# EAGLE design Wheel speed tester rev1 (EAGLE 9.6.2)
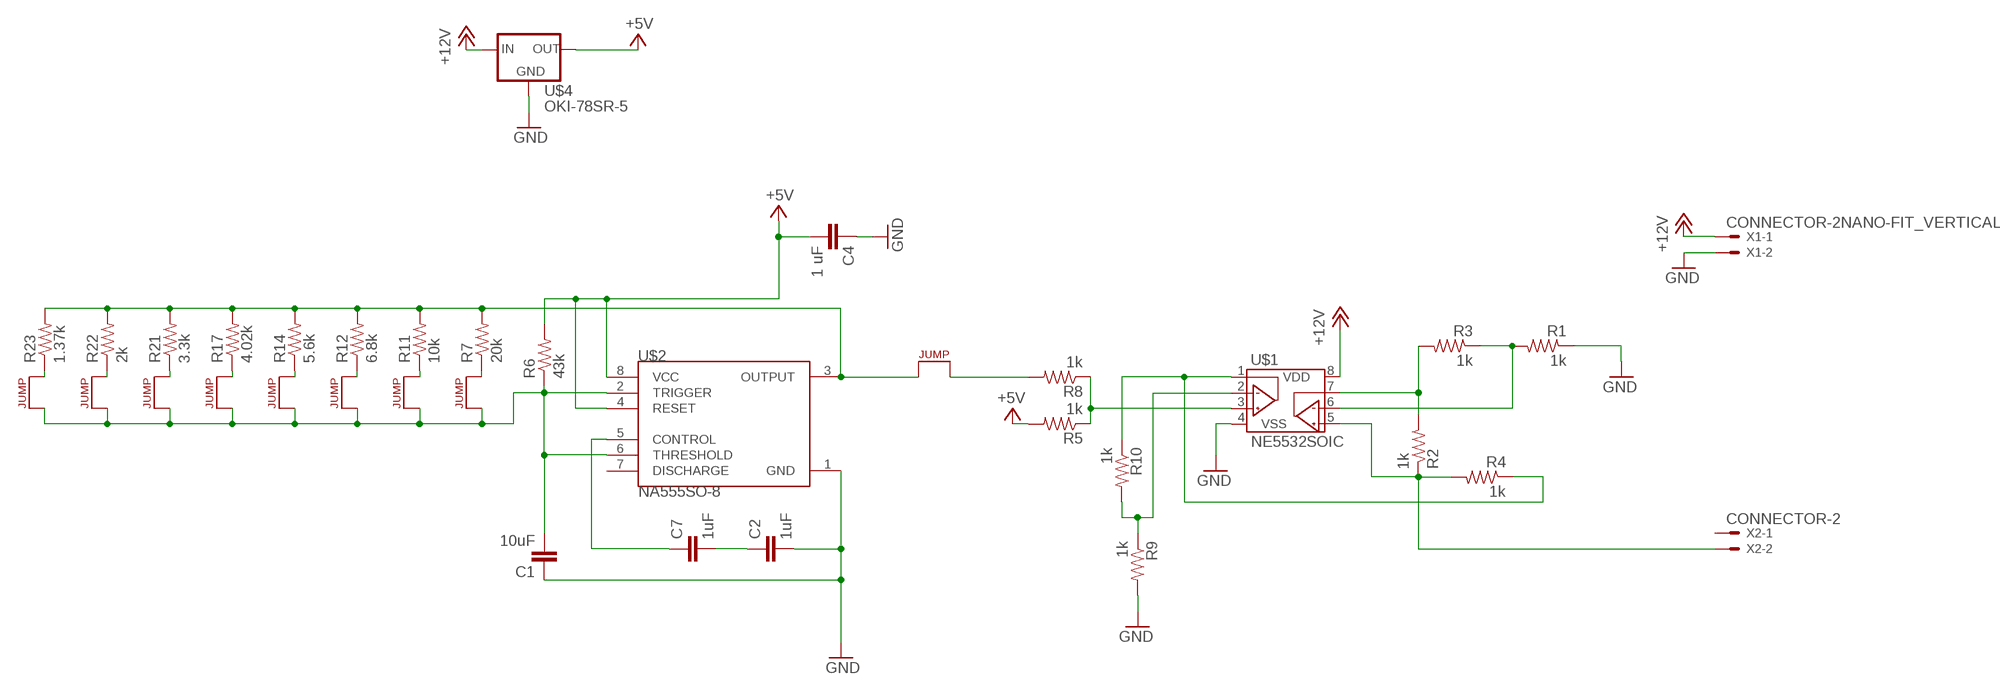
[diagram p0: schematic, sheet 1, part 1 of 2]
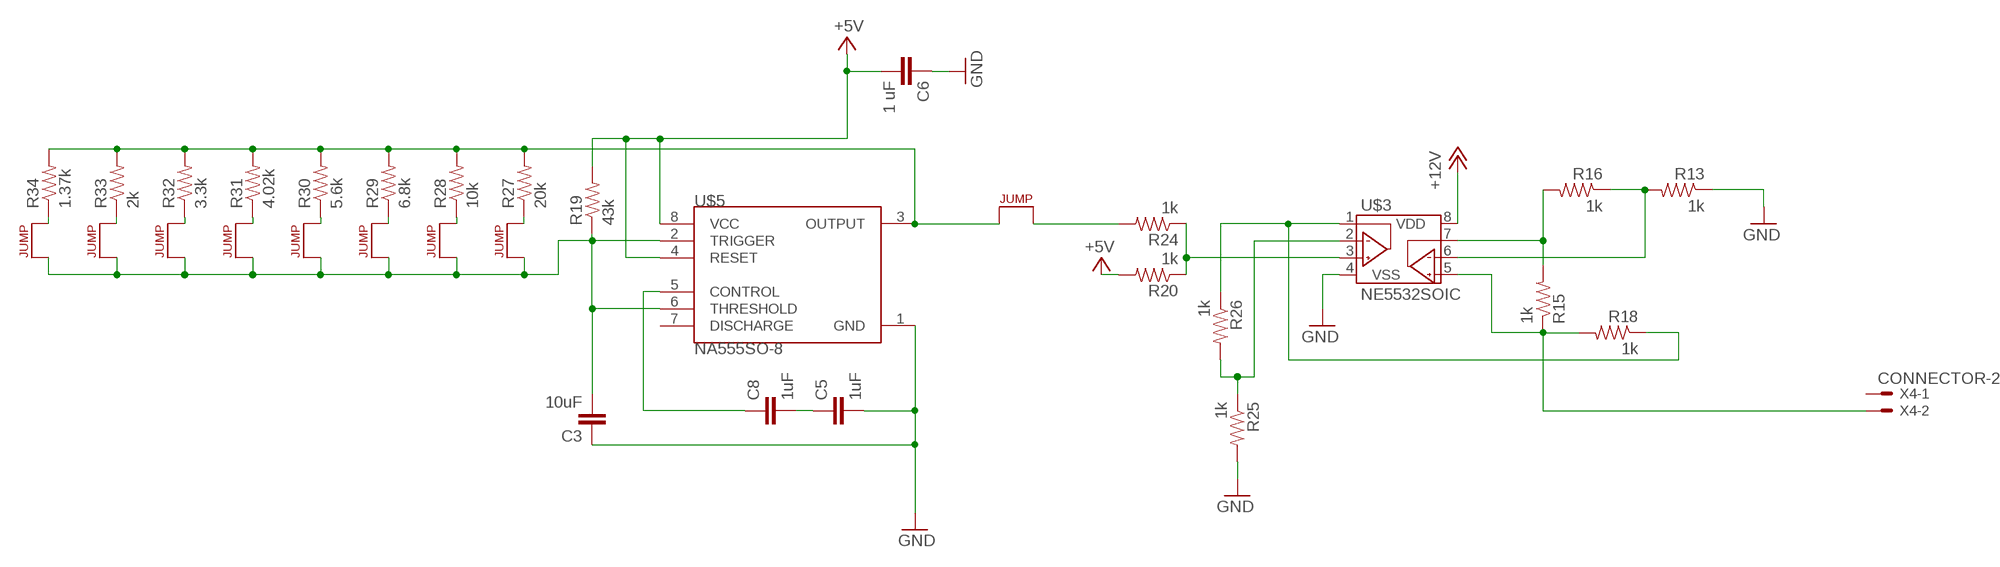
[diagram p1: schematic, sheet 1, part 2 of 2]

## Parts
C1  10uF  CAP0603-CAP  [0603-CAP]
C2  1uF  CAP0603-CAP  [0603-CAP]
C3  10uF  CAP0603-CAP  [0603-CAP]
C4  1 uF  CAP0603-CAP  [0603-CAP]
C5  1uF  CAP0603-CAP  [0603-CAP]
C6  1 uF  CAP0603-CAP  [0603-CAP]
C7  1uF  CAP0603-CAP  [0603-CAP]
C8  1uF  CAP0603-CAP  [0603-CAP]
J1  JUMPER.1  [1X02]
J2  JUMPER.1  [1X02]
J3  JUMPER.1  [1X02]
J4  JUMPER.1  [1X02]
J5  JUMPER.1  [1X02]
J6  JUMPER.1  [1X02]
J7  JUMPER.1  [1X02]
J8  JUMPER.1  [1X02]
J9  JUMPER.1  [1X02]
J10  JUMPER.1  [1X02]
J11  JUMPER.1  [1X02]
J12  JUMPER.1  [1X02]
J13  JUMPER.1  [1X02]
J14  JUMPER.1  [1X02]
J15  JUMPER.1  [1X02]
J16  JUMPER.1  [1X02]
J17  JUMPER.1  [1X02]
J18  JUMPER.1  [1X02]
R1  1k  RESISTOR0603  [0603-RES]
R2  1k  RESISTOR0603  [0603-RES]
R3  1k  RESISTOR0603  [0603-RES]
R4  1k  RESISTOR0603  [0603-RES]
R5  1k  RESISTOR0603  [0603-RES]
R6  43k  RESISTOR0603  [0603-RES]
R7  20k  RESISTOR0603  [0603-RES]
R8  1k  RESISTOR0603  [0603-RES]
R9  1k  RESISTOR0603  [0603-RES]
R10  1k  RESISTOR0603  [0603-RES]
R11  10k  RESISTOR0603  [0603-RES]
R12  6.8k  RESISTOR0603  [0603-RES]
R13  1k  RESISTOR0603  [0603-RES]
R14  5.6k  RESISTOR0603  [0603-RES]
R15  1k  RESISTOR0603  [0603-RES]
R16  1k  RESISTOR0603  [0603-RES]
R17  4.02k  RESISTOR0603  [0603-RES]
R18  1k  RESISTOR0603  [0603-RES]
R19  43k  RESISTOR0603  [0603-RES]
R20  1k  RESISTOR0603  [0603-RES]
R21  3.3k  RESISTOR0603  [0603-RES]
R22  2k  RESISTOR0603  [0603-RES]
R23  1.37k  RESISTOR0603  [0603-RES]
R24  1k  RESISTOR0603  [0603-RES]
R25  1k  RESISTOR0603  [0603-RES]
R26  1k  RESISTOR0603  [0603-RES]
R27  20k  RESISTOR0603  [0603-RES]
R28  10k  RESISTOR0603  [0603-RES]
R29  6.8k  RESISTOR0603  [0603-RES]
R30  5.6k  RESISTOR0603  [0603-RES]
R31  4.02k  RESISTOR0603  [0603-RES]
R32  3.3k  RESISTOR0603  [0603-RES]
R33  2k  RESISTOR0603  [0603-RES]
R34  1.37k  RESISTOR0603  [0603-RES]
U$1  NE5532SOIC  [SOIC-08]
U$2  NA555SO-8  [SOIC-08]
U$3  NE5532SOIC  [SOIC-08]
U$4  OKI-78SR-5  [OKI-78SR]
U$5  NA555SO-8  [SOIC-08]
X1  CONNECTOR-2NANO-FIT_VERTICAL-2  [NANO-FIT_VERTICAL-2]
X2  CONNECTOR-2  [MINIFIT_5566-2]
X4  CONNECTOR-2  [MINIFIT_5566-2]

## Nets
+5V: C4.2 C6.2 R5.2 R6.2 R19.2 R20.2 U$2.4(RESET) U$2.8(VCC) U$4.3(OUT) U$5.4(RESET) U$5.8(VCC)
+12V: U$1.8(VDD) U$3.8(VDD) U$4.1(IN) X1.P$1
ALTERNATINGVOLTAGE: R4.1 R10.1 U$1.1(VOUTA)
ALTERNATINGVOLTAGE1: R18.1 R26.1 U$3.1(VOUTA)
GND: C1.1 C2.2 C3.1 C4.1 C5.2 C6.1 R1.1 R9.2 R13.1 R25.2 U$1.4(VSS) U$2.1(GND) U$3.4(VSS) U$4.2(GND) U$5.1(GND) X1.P$2
N$1: R2.2 R3.2 U$1.7(VOUTB)
N$2: R1.2 R3.1 U$1.6(VINB-)
N$3: C7.1 U$2.5(CONTROL)
N$4: J2.2 R8.2
N$5: C1.2 J1.1 J3.1 J4.1 J5.1 J6.1 J7.1 J8.1 J9.1 R6.1 U$2.2(TRIGGER) U$2.6(THRESHOLD)
N$6: R5.1 R8.1 U$1.3(VINA+)
N$7: J9.2 R7.1
N$8: J2.1 R7.2 R11.2 R12.2 R14.2 R17.2 R21.2 R22.2 R23.2 U$2.3(OUTPUT)
N$9: R9.1 R10.2 U$1.2(VINA-)
N$10: J8.2 R11.1
N$11: J7.2 R12.1
N$12: J6.2 R14.1
N$13: J5.2 R17.1
N$14: J4.2 R21.1
N$15: J3.2 R22.1
N$16: J1.2 R23.1
N$17: R13.2 R16.1 U$3.6(VINB-)
N$18: J10.1 R27.2 R28.2 R29.2 R30.2 R31.2 R32.2 R33.2 R34.2 U$5.3(OUTPUT)
N$19: R20.1 R24.1 U$3.3(VINA+)
N$20: R15.2 R16.2 U$3.7(VOUTB)
N$21: R25.1 R26.2 U$3.2(VINA-)
N$22: C3.2 J11.1 J12.1 J13.1 J14.1 J15.1 J16.1 J17.1 J18.1 R19.1 U$5.2(TRIGGER) U$5.6(THRESHOLD)
N$23: C8.1 U$5.5(CONTROL)
N$24: J10.2 R24.2
N$25: J18.2 R27.1
N$26: J17.2 R28.1
N$27: J16.2 R29.1
N$28: J15.2 R30.1
N$29: J14.2 R31.1
N$30: J13.2 R32.1
N$31: J12.2 R33.1
N$32: J11.2 R34.1
N$33: C2.1 C7.2
N$34: C5.1 C8.2
SENSOROUT: R2.1 R4.2 U$1.5(VINB+) X2.2
SENSOROUT1: R15.1 R18.2 U$3.5(VINB+) X4.2
Unconnected: U$2.7(DISCHARGE) U$5.7(DISCHARGE) X2.1 X4.1

## Library data of the parts
C1-C8 = HyTechDevices:CAP: Capacitor Standard 0603 ceramic capacitor, and 0.1" leaded capacitor.
J1-J18 = HyTechDevices:JUMPER: Jumper for changing operation of a device
R1-R34 = HyTechDevices:RESISTOR: Resistor Basic schematic elements and footprints for 0603, 1206, and PTH resistors.
U$1 U$3 = HyTechDevices:NE5532: TI NE5532 Dual Channel Op Amp
U$2 U$5 = HyTechDevices:NA555: Texas Instruments NA555 timer. Data sheet <http://www.ti.com/lit/ds/symlink/se555.pdf>
U$4 = HyTechDevices:OKI-78SR-5: Murata OKI-78SR 5V 1.5A Non-Isolated Switching Regulator DC/DC - Datasheet <https://power.murata.com/data/power/oki-78sr.pdf>
X1 = HyTechDevices:CONNECTOR-2: Mini-Fit Junior connector 2 pole Source: http://www.molex.com
X2 X4 = HyTechDevices:CONNECTOR-2: Mini-Fit Junior connector 2 pole Source: http://www.molex.com; OC_FARNELL: 1822072; OC_NEWARK: unknown

## Board
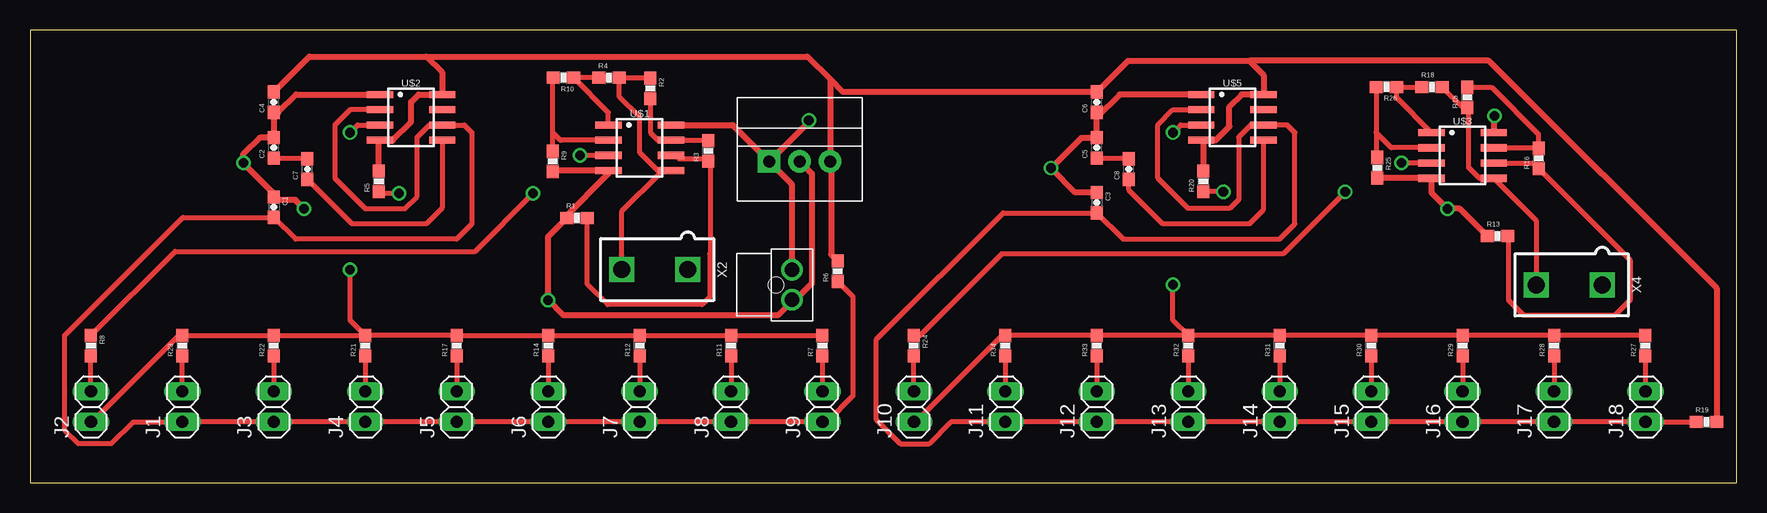
[diagram p2: board, top side]
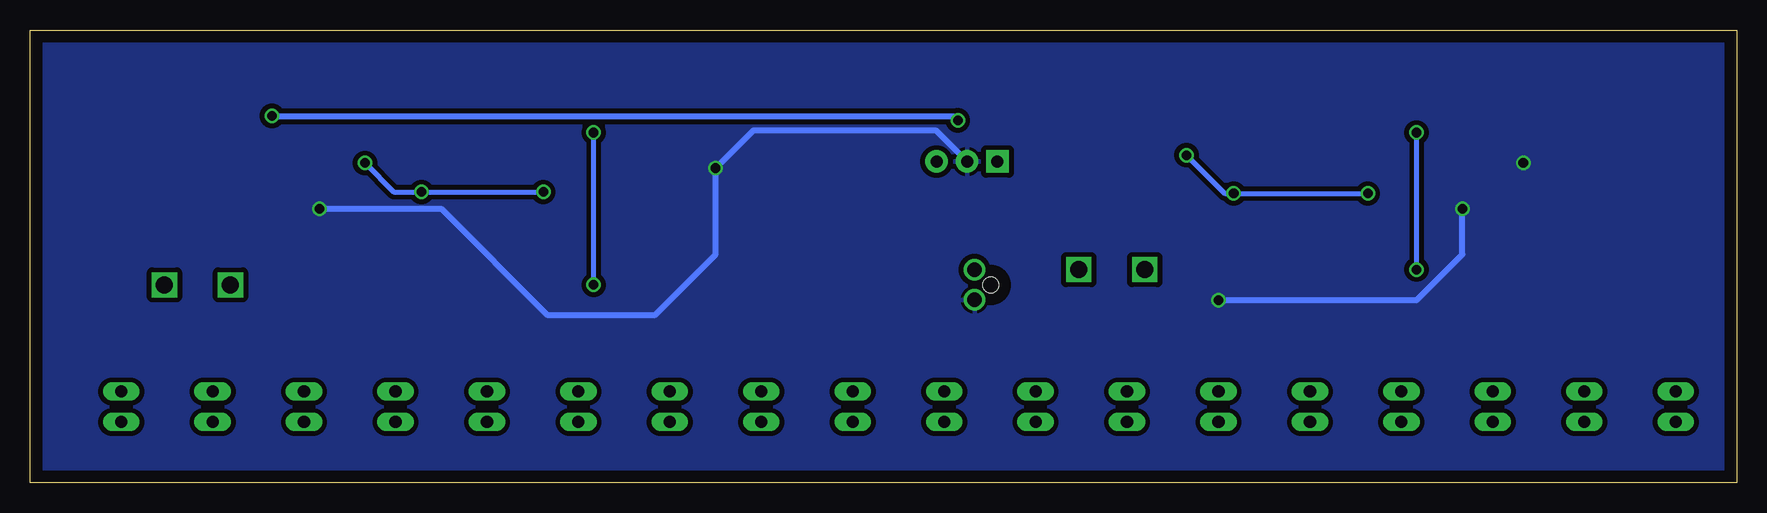
[diagram p3: board, bottom side, seen from below]

Size 142.22 x 37.77 mm. Coordinates in mm from the lower left corner, seen from the top.
Outline: 0,0 142.22,0 142.22,37.77 0,37.77 0,0
Copper layers (1*16): Top 0.035mm / dielectric 1.5mm / Bottom 0.035mm
Design rules "On Campus (2 Layer)": minimum track width 16mil, minimum drill 0.8mm, track to track 16mil, track to pad 12mil, pad to pad 16mil, via to via 16mil, smd to smd 10mil, copper to edge 40mil, drill to drill 10mil, minimum pad ring 10mil, minimum via ring 8mil, stop-mask expansion 4mil, vias tented up to drill 0mil, thermal gap 10mil

### Footprints (pad centres in the part's own frame; a part is rotated, then mirrored left to right if it is on the bottom)
0603-CAP = smd 1.1 x 1: 1 -0.85,0; 2 0.85,0
1X02 = drill 1.016 long: 1 -1.27,0; 2 1.27,0
0603-RES = smd 1.1 x 1: 1 -0.85,0; 2 0.85,0
SOIC-08 = smd 0.6 x 2.2: 1 -1.905,-2.6; 2 -0.635,-2.6; 3 0.635,-2.6; 4 1.905,-2.6; 5 1.905,2.6; 6 0.635,2.6; 7 -0.635,2.6; 8 -1.905,2.6
OKI-78SR = drill 1 pad 1.88 square: 1 -2.54,0 | drill 1 pad 1.88: 2 0,0; 3 2.54,0
NANO-FIT_VERTICAL-2 = drill 1.2: P$1 -1.25,0; P$2 1.25,0 | hole 1.3: 0,-1.34
MINIFIT_5566-2 = drill 1.4 square: 1 0,-2.75; 2 0,2.75

### Placement (x,y rotation side)
C1  20.32,22.99 270 top
C2  20.32,27.94 90 top
C3  88.9,23.37 270 top
C4  20.32,31.75 90 top
C5  88.9,27.94 90 top
C6  88.9,31.75 90 top
C7  23.11,26.16 90 top
C8  91.57,26.16 90 top
J1  12.7,6.35 90 top
J2  5.08,6.35 90 top
J3  20.32,6.35 90 top
J4  27.94,6.35 90 top
J5  35.56,6.35 90 top
J6  43.18,6.35 90 top
J7  50.8,6.35 90 top
J8  58.42,6.35 90 top
J9  66.04,6.35 90 top
J10  73.66,6.35 90 top
J11  81.28,6.35 90 top
J12  88.9,6.35 90 top
J13  96.52,6.35 90 top
J14  104.14,6.35 90 top
J15  111.76,6.35 90 top
J16  119.38,6.35 90 top
J17  127,6.35 90 top
J18  134.62,6.35 90 top
R1  45.59,22.1 0 top
R2  51.69,32.89 270 top
R3  56.52,27.69 90 top
R4  48.26,33.78 0 top
R5  29.08,25.15 90 top
R6  67.31,17.65 90 top
R7  66.04,11.43 90 top
R8  5.08,11.43 270 top
R9  43.56,26.8 270 top
R10  44.45,33.78 180 top
R11  58.42,11.43 90 top
R12  50.8,11.43 90 top
R13  122.3,20.57 0 top
R14  43.18,11.43 90 top
R15  119.76,32.13 90 top
R16  125.73,27.05 90 top
R17  35.56,11.43 90 top
R18  116.84,33.02 0 top
R19  139.7,5.08 0 top
R20  97.79,25.15 90 top
R21  27.94,11.43 90 top
R22  20.32,11.43 90 top
R23  12.7,11.43 90 top
R24  73.66,11.43 270 top
R25  112.27,26.29 270 top
R26  113.03,33.02 180 top
R27  134.62,11.43 90 top
R28  127,11.43 90 top
R29  119.38,11.43 90 top
R30  111.76,11.43 90 top
R31  104.14,11.43 90 top
R32  96.52,11.43 90 top
R33  88.9,11.43 90 top
R34  81.28,11.43 90 top
U$1  50.8,27.94 270 top
U$2  31.75,30.48 270 top
U$3  119.38,27.3 270 top
U$4  64.14,26.8 0 top
U$5  100.2,30.48 270 top
X1  63.5,16.51 270 top
X2  52.07,17.78 90 top
X4  128.27,16.51 90 top

### Tracks (layer width: path | path; a pad name or v marks a point on that pad's centre or on a via)
+5V
  Top 0.508: C4.2 23.28,35.56 33.02,35.56 | 66.67,33.66 64.77,35.56 33.02,35.56 | 66.67,33.66 U$4.3 66.76,26.71 66.76,19.05 R6.2 | 66.67,33.66 67.73,32.6 C6.2 91.51,35.21 101.6,35.21 | R19.2 140.55,16.23 121.57,35.21 101.6,35.21 | 33.02,35.56 34.35,34.23 U$2.8 32.38,32.39 31.75,31.75 31.75,30.09 30.24,28.58 U$2.4 29.08,28.51 R5.2 | 101.6,35.21 102.8,34 U$5.8 100.96,32.39 99.95,31.37 99.95,29.72 98.81,28.58 U$5.4 97.79,28.39 R20.2
+12V  (via drill 0.8)
  Top 0.508: U$1.8 58.55,29.84 U$4.1 | v64.9,30.23 64.9,30.1 U$4.1 | X1.P$1 63.47,17.78 63.47,24.92 U$4.1 | v122.05,30.61 121.98,30.54 U$3.8
  Bottom 0.508: v122.05,30.61 121.97,30.53 65.2,30.53 v64.9,30.23
ALTERNATINGVOLTAGE
  Top 0.406: R4.1 R10.1 48.2,30.88 U$1.1
ALTERNATINGVOLTAGE1
  Top 0.406: U$3.1 113.88,32.11 R26.1 R18.1
GND  (via drill 0.8)
  Top 0.406: 112.31,25.4 R25.2
  Top 0.508: R9.2 43.47,26.03 U$1.4 48.2,25.78 44.52,22.1 R1.1 43.18,20.53 v43.18,15.24 44.45,13.97 62.33,13.97 63.5,15.13 X1.P$2 63.77,15.26 65.15,16.64 65.15,25.78 U$4.2 | 88.9,30.48 C5.2 87.63,28.79 v85.09,26.25 87.12,24.22 C3.1 | 88.9,30.48 C6.1 | 112.31,25.4 U$3.4 116.78,24.19 v118.11,22.86 119.17,22.86 R13.1 | U$5.1 90.8,32.39 88.9,30.48 | U$2.1 22.19,32.39 20.7,30.9 C4.1 C2.2 19.12,28.79 17.78,27.45 v17.78,26.67 20.32,24.13 C1.1 20.32,23.58 22.11,23.58 v22.85,22.85
  Bottom 0.508: U$4.2 66.75,29.41 81.93,29.41 v85.09,26.25 85.09,19.05 90.17,13.97 99.06,13.97 107.95,22.86 v118.11,22.86 | v43.18,15.24 26.67,15.24 22.86,19.05 v22.86,22.86 v22.85,22.85
  pour Bottom: 0,38.1 0,0 142.24,0 142.24,38.1
N$1
  Top 0.406: R2.2 51.69,29.21 52.32,28.58 U$1.7 56.48,28.58 R3.2
N$2
  Top 0.406: R1.2 46.44,16.55 48.13,14.86 56.01,14.86 56.64,15.49 56.64,19.09 56.73,19.18 56.73,26.62 56.6,26.75 R3.1 56.35,27 54.08,27 53.78,27.3 U$1.6
N$3
  Top 0.406: U$2.5 34.35,22.92 33.02,21.59 26.84,21.59 C7.1
N$4
  Top 0.406: J2.2 R8.2
N$5
  Top 0.406: R6.1 68.58,15.53 68.58,7.24 66.42,5.08 J9.1 J8.1 J7.1 J6.1 J5.1 J4.1 J3.1 J1.1 8.58,5.08 6.78,3.28 4.01,3.28 2.9,4.4 2.9,12.3 12.73,22.14 C1.2 22.14,20.32 35.56,20.32 36.83,21.59 36.83,29.21 36.19,29.84 U$2.6 33.27,29.84 32.26,28.83 32.26,23.88 31.24,22.86 27.94,22.86 25.4,25.4 25.4,29.84 26.67,31.12 U$2.2
N$6  (via drill 0.8)
  Top 0.406: R8.1 12.1,19.3 37.08,19.3 v41.91,24.13 | v30.73,24.13 29.25,24.13 R5.1 | v45.85,27.33 48.18,27.33 U$1.3
  Bottom 0.406: v45.85,27.33 42.65,24.13 v41.91,24.13 v30.73,24.13
N$7
  Top 0.406: R7.1 J9.2
N$8  (via drill 0.8)
  Top 0.406: J2.1 5.21,5.08 12.41,12.28 R23.2 R22.2 R21.2 | R21.2 R17.2 R14.2 R12.2 R11.2 R7.2 | R21.2 26.67,13.55 v26.67,17.78 | v26.67,29.21 27.3,29.84 U$2.3
  Bottom 0.406: v26.67,17.78 v26.67,29.21
N$9
  Top 0.406: R9.1 43.56,29.21 | 43.56,29.21 43.56,33.74 R10.2 | U$1.2 44.2,28.58 43.56,29.21
N$10
  Top 0.406: R11.1 J8.2
N$11
  Top 0.406: R12.1 J7.2
N$12
  Top 0.406: R14.1 J6.2
N$13
  Top 0.406: R17.1 J5.2
N$14
  Top 0.406: R21.1 J4.2
N$15
  Top 0.406: R22.1 J3.2
N$16
  Top 0.406: J1.2 R23.1
N$17
  Top 0.406: U$3.6 125.26,26.67 R16.1 133.35,18.58 133.35,15.24 132.08,13.97 124.46,13.97 123.19,15.24 123.19,20.53 R13.2
N$18  (via drill 0.8)
  Top 0.406: R27.2 R28.2 R29.2 R30.2 R31.2 R32.2 | R32.2 R33.2 R34.2 81.03,12.28 73.83,5.08 J10.1 | R32.2 95.25,13.55 v95.25,16.51 | v95.25,29.21 95.89,29.84 U$5.3
  Bottom 0.406: v95.25,16.51 v95.25,29.21
N$19  (via drill 0.8)
  Top 0.406: R24.1 74.17,12.28 80.98,19.09 85.09,19.09 104.43,19.09 v109.6,24.26 | U$3.3 v114.3,26.67 | v99.44,24.26 99.4,24.3 R20.1
  Bottom 0.406: v114.3,26.67 111.89,24.26 v109.6,24.26 v99.44,24.26
N$20
  Top 0.406: U$3.7 125.69,27.94 | 125.69,27.94 R16.2 | R15.2 121.79,32.98 125.69,29.08 125.69,27.94
N$21
  Top 0.406: R26.2 112.18,29.21 | 112.18,29.21 112.18,27.23 R25.1 | U$3.2 113.45,27.94 112.18,29.21
N$22
  Top 0.406: R19.1 J18.1 J17.1 J16.1 J15.1 J14.1 J13.1 J12.1 J11.1 76.75,5.08 74.88,3.21 72.57,3.21 70.52,5.26 70.52,11.95 81.09,22.52 C3.2 91.1,20.32 104.14,20.32 105.41,21.59 105.41,29.21 104.77,29.84 U$5.6 101.73,29.84 100.71,28.83 100.71,23.62 99.97,22.88 96.52,22.88 93.98,25.42 93.98,29.84 95.25,31.12 U$5.2
N$23
  Top 0.406: U$5.5 102.8,22.79 101.6,21.59 94.4,21.59 91.57,24.42 C8.1
N$24
  Top 0.406: J10.2 R24.2
N$25
  Top 0.406: R27.1 J18.2
N$26
  Top 0.406: R28.1 J17.2
N$27
  Top 0.406: R29.1 J16.2
N$28
  Top 0.406: R30.1 J15.2
N$29
  Top 0.406: R31.1 J14.2
N$30
  Top 0.406: R32.1 J13.2
N$31
  Top 0.406: R33.1 J12.2
N$32
  Top 0.406: R34.1 J11.2
N$33
  Top 0.406: C2.1 23.04,27.09 C7.2
N$34
  Top 0.406: C5.1 91.49,27.09 C8.2
SENSOROUT
  Top 0.406: 52.52,25.84 50.8,27.56 50.8,30.48 49.11,32.17 R4.2 51.65,33.78 R2.1 | U$1.5 52.7,26.03 52.52,25.84 | 52.52,25.84 49.32,22.65 X2.2
SENSOROUT1
  Top 0.406: R18.2 119.43,31.28 R15.1 119.97,31.07 119.89,30.99 119.89,26.29 120.78,25.4 U$3.5 125.52,21.86 X4.2